# Altium project MGMEZZ04.PrjPCB (part 1 of 3)
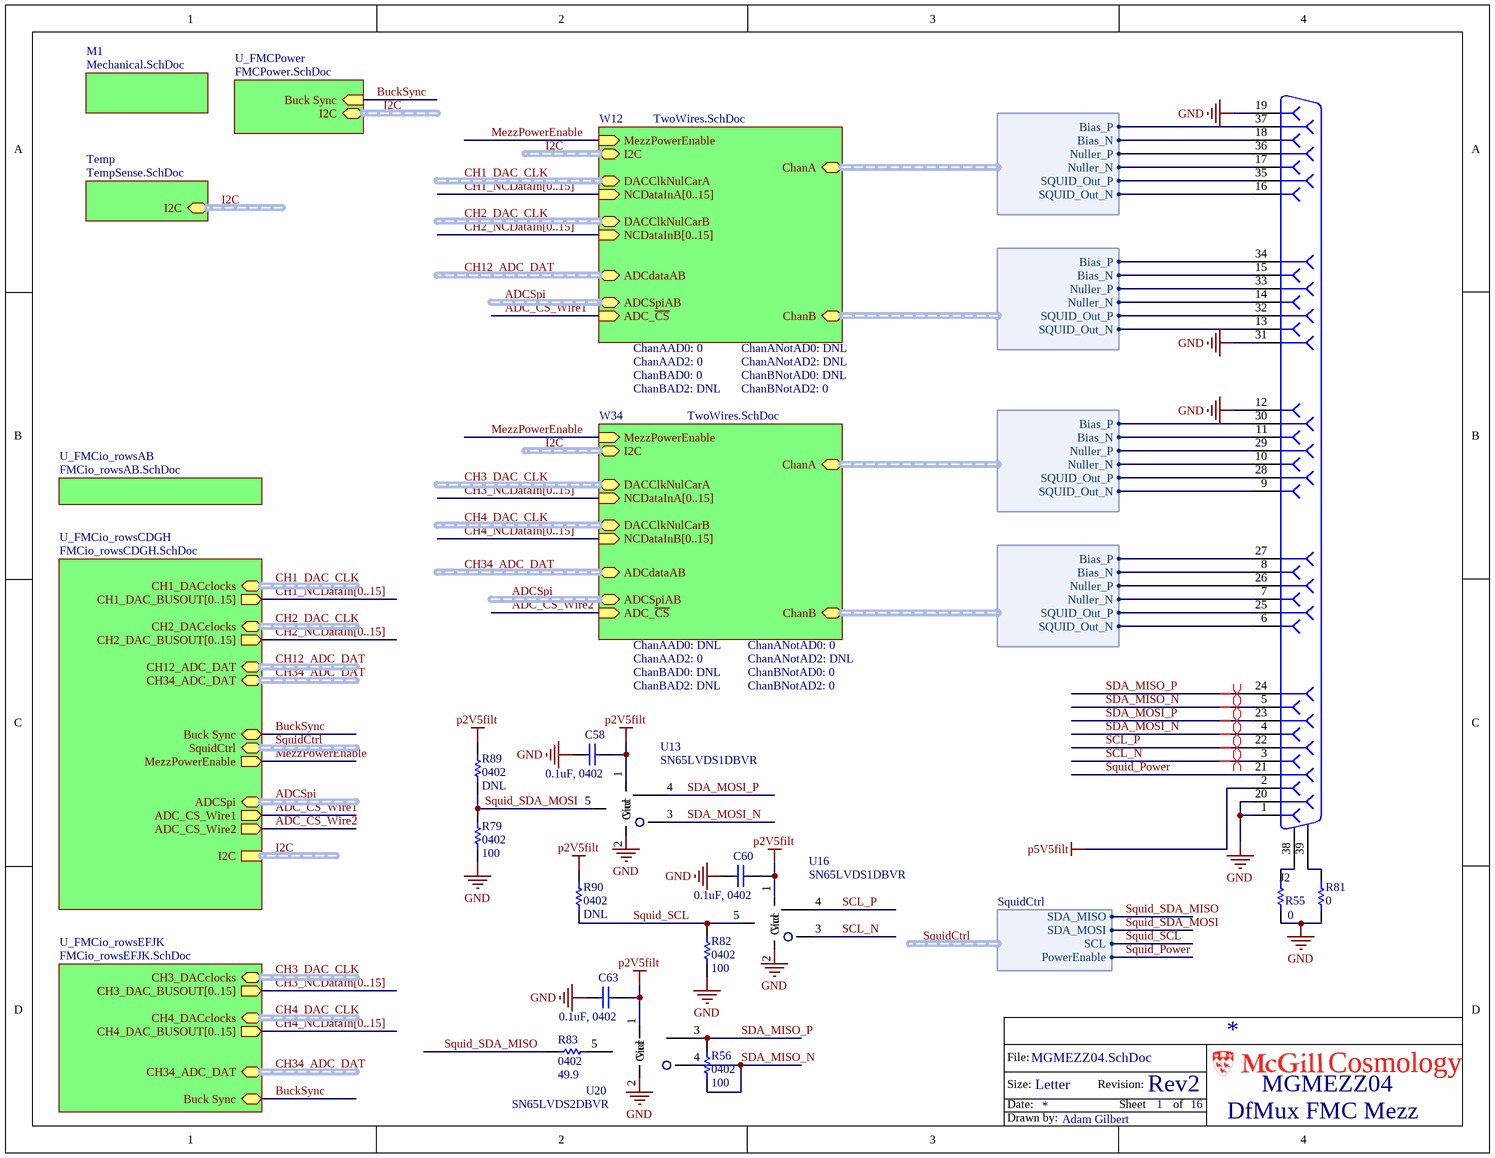
[diagram p0: MGMEZZ04.SchDoc]
ModelNumber: MGMEZZ04; ProjectTitle: Dan DfMux Mezz; revision: 0
15 sheets, 919 parts. Net scope: hierarchical (ports join the sheet entries above them; power ports are global).
Board file: MGMEZZ04.PcbDoc
Sheets:
  MGMEZZ04.SchDoc
    U_FMCio_rowsAB = FMCio_rowsAB.SchDoc
    U_FMCio_rowsCDGH = FMCio_rowsCDGH.SchDoc
    U_FMCio_rowsEFJK = FMCio_rowsEFJK.SchDoc
      Dup2 = BusDup.SchDoc
      Dup1 = BusDup.SchDoc
    U_FMCPower = FMCPower.SchDoc
      BP = BuckReg.SchDoc
      BN = BuckReg.SchDoc
    W12 = TwoWires.SchDoc
      DACNulCarA = NullerCarrier.SchDoc
        N = DAC.SchDoc
          PR = ProgramableResistor.SchDoc
        C = DAC.SchDoc
          PR = ProgramableResistor.SchDoc
        Tr1 = LvlTranslate.SchDoc
      DemodAB = ADC.SchDoc
      DACNulCarB = NullerCarrier.SchDoc
        N = DAC.SchDoc
          PR = ProgramableResistor.SchDoc
        C = DAC.SchDoc
          PR = ProgramableResistor.SchDoc
        Tr1 = LvlTranslate.SchDoc
    W34 = TwoWires.SchDoc
      DACNulCarA = NullerCarrier.SchDoc
        N = DAC.SchDoc
          PR = ProgramableResistor.SchDoc
        C = DAC.SchDoc
          PR = ProgramableResistor.SchDoc
        Tr1 = LvlTranslate.SchDoc
      DemodAB = ADC.SchDoc
      DACNulCarB = NullerCarrier.SchDoc
        N = DAC.SchDoc
          PR = ProgramableResistor.SchDoc
        C = DAC.SchDoc
          PR = ProgramableResistor.SchDoc
        Tr1 = LvlTranslate.SchDoc
    M1 = Mechanical.SchDoc
    Temp = TempSense.SchDoc

## Sheet MGMEZZ04.SchDoc
size Letter; Author: Adam Gilbert; CompanyName: McGill University; DrawnBy: Adam Gilbert; Organization: Altium Limited; Address1: McGill Cosmology; Address2: 3600 University Street; Address3: Montreal, Quebec; Address4: Canada; DocumentNumber: 1; Revision: Rev2; SheetNumber: 1; SheetTotal: 16; ProjectTitle: DfMux FMC Mezz; ModelNumber: MGMEZZ04; ProjectName: DfMux FMC Mezz

### Parts
C58  0.1uF, 0402  [0402]
C60  0.1uF, 0402  [0402]
C63  0.1uF, 0402  [0402]
J2  DB37F_Resize  [DSUB37-F]  (value not drawn)
R55  0  [0603]
R56  100  [0402]
R79  100  [0402]
R81  0  [0603]
R82  100  [0402]
R83  49.9  [0402]
R89  DNL  [0402]
R90  DNL  [0402]
U13  SN65LVDS1DBVR  [SOT23-5]
U16  SN65LVDS1DBVR  [SOT23-5]
U20  SN65LVDS2DBVR  [SOT23-5]

### Sub-sheets
M1 = Mechanical.SchDoc: no entries
Temp = TempSense.SchDoc: I2C (harness I2C)
U_FMCio_rowsAB = FMCio_rowsAB.SchDoc: no entries
U_FMCio_rowsCDGH = FMCio_rowsCDGH.SchDoc: I2C (harness I2C), ADCSpi (harness ADCSPI), ADC_CS_Wire1 (out), ADC_CS_Wire2 (out), CH1_DACclocks (harness DACclks), CH2_DACclocks (harness DACclks), Buck Sync, MezzPowerEnable (out), SquidCtrl (harness SquidCtrl), CH34_ADC_DAT (harness ADCData), CH12_ADC_DAT (harness ADCData), CH1_DAC_BUSOUT[0..15] (out), CH2_DAC_BUSOUT[0..15] (out)
U_FMCio_rowsEFJK = FMCio_rowsEFJK.SchDoc: CH34_ADC_DAT (harness ADCData), CH3_DACclocks (harness DACclks), CH4_DACclocks (harness DACclks), Buck Sync, CH3_DAC_BUSOUT[0..15] (out), CH4_DAC_BUSOUT[0..15] (out)
U_FMCPower = FMCPower.SchDoc: Buck Sync (in), I2C (harness I2C)
W12 = TwoWires.SchDoc: ADCSpiAB (harness ADCSPI), ADCdataAB (harness ADCData), NCDataInA[0..15] (in), NCDataInB[0..15] (in), DACClkNulCarA (harness DACclks), DACClkNulCarB (harness DACclks), ADC_~{CS} (in), ChanA (harness SQUID_CH_OUT), ChanB (harness SQUID_CH_OUT), I2C (harness I2C), MezzPowerEnable (in)  | ChanANotAD0: DNL; ChanANotAD2: DNL; ChanBNotAD0: DNL; ChanBNotAD2: 0; ChanAAD0: 0; ChanAAD2: 0; ChanBAD0: 0; ChanBAD2: DNL
W34 = TwoWires.SchDoc: ADCSpiAB (harness ADCSPI), ADCdataAB (harness ADCData), NCDataInA[0..15] (in), NCDataInB[0..15] (in), DACClkNulCarA (harness DACclks), DACClkNulCarB (harness DACclks), ADC_~{CS} (in), ChanA (harness SQUID_CH_OUT), ChanB (harness SQUID_CH_OUT), I2C (harness I2C), MezzPowerEnable (in)  | ChanANotAD0: 0; ChanANotAD2: DNL; ChanBNotAD0: 0; ChanBNotAD2: 0; ChanAAD0: DNL; ChanAAD2: 0; ChanBAD0: DNL; ChanBAD2: DNL

### Harnesses
SQUID_CH_OUT: Bias_P, Bias_N, Nuller_P, Nuller_N, SQUID_Out_P, SQUID_Out_N
SquidCtrl: SDA_MISO, SDA_MOSI, SCL, PowerEnable

### Nets
GND: C58.2 C60.2 C63.2 J2.1 J2.12 J2.19 J2.20 J2.31 R55.1 R79.1 R81.2 R82.1 U13.2(Gnd) U16.2(Gnd) U20.2(Gnd)
p2V5filt: C58.1 C60.1 C63.1 R89.2 R90.2 U13.1(Vcc) U16.1(Vcc) U20.1(Vcc)
p5V5filt: J2.2
ADC_CS_Wire1: sheet U_FMCio_rowsCDGH/ADC_CS_Wire1, sheet W12/ADC_~{CS}
ADC_CS_Wire2: sheet U_FMCio_rowsCDGH/ADC_CS_Wire2, sheet W34/ADC_~{CS}
ADCin1_N: J2.9 ; sheet W34/ChanA.SQUID_Out_N
ADCin1_N: J2.16 ; sheet W12/ChanA.SQUID_Out_N  [a separate net that carries the same name]
ADCin1_P: J2.28 ; sheet W34/ChanA.SQUID_Out_P
ADCin1_P: J2.35 ; sheet W12/ChanA.SQUID_Out_P  [a separate net that carries the same name]
ADCin2_N: J2.6 ; sheet W34/ChanB.SQUID_Out_N
ADCin2_N: J2.13 ; sheet W12/ChanB.SQUID_Out_N  [a separate net that carries the same name]
ADCin2_P: J2.25 ; sheet W34/ChanB.SQUID_Out_P
ADCin2_P: J2.32 ; sheet W12/ChanB.SQUID_Out_P  [a separate net that carries the same name]
BuckSync: sheet U_FMCio_rowsCDGH/Buck Sync, sheet U_FMCio_rowsEFJK/Buck Sync, sheet U_FMCPower/Buck Sync
CO.DACout_N: J2.8 ; sheet W34/ChanB.Bias_N
CO.DACout_N: J2.11 ; sheet W34/ChanA.Bias_N  [a separate net that carries the same name]
CO.DACout_N: J2.15 ; sheet W12/ChanB.Bias_N  [a separate net that carries the same name]
CO.DACout_N: J2.18 ; sheet W12/ChanA.Bias_N  [a separate net that carries the same name]
CO.DACout_P: J2.27 ; sheet W34/ChanB.Bias_P
CO.DACout_P: J2.30 ; sheet W34/ChanA.Bias_P  [a separate net that carries the same name]
CO.DACout_P: J2.34 ; sheet W12/ChanB.Bias_P  [a separate net that carries the same name]
CO.DACout_P: J2.37 ; sheet W12/ChanA.Bias_P  [a separate net that carries the same name]
MezzPowerEnable: sheet U_FMCio_rowsCDGH/MezzPowerEnable, sheet W12/MezzPowerEnable, sheet W34/MezzPowerEnable
NO.DACout_N: J2.7 ; sheet W34/ChanB.Nuller_N
NO.DACout_N: J2.10 ; sheet W34/ChanA.Nuller_N  [a separate net that carries the same name]
NO.DACout_N: J2.14 ; sheet W12/ChanB.Nuller_N  [a separate net that carries the same name]
NO.DACout_N: J2.17 ; sheet W12/ChanA.Nuller_N  [a separate net that carries the same name]
NO.DACout_P: J2.26 ; sheet W34/ChanB.Nuller_P
NO.DACout_P: J2.29 ; sheet W34/ChanA.Nuller_P  [a separate net that carries the same name]
NO.DACout_P: J2.33 ; sheet W12/ChanB.Nuller_P  [a separate net that carries the same name]
NO.DACout_P: J2.36 ; sheet W12/ChanA.Nuller_P  [a separate net that carries the same name]
SCL_N: J2.3 U16.3(A)
SCL_P: J2.22 U16.4(B)
SDA_MISO_N: J2.5 R56.2 U20.4(B)
SDA_MISO_P: J2.24 R56.1 U20.3(A)
SDA_MOSI_N: J2.4 U13.3(A)
SDA_MOSI_P: J2.23 U13.4(B)
Squid_Power: J2.21 ; sheet U_FMCio_rowsCDGH/SquidCtrl.PowerEnable
Squid_SCL: R82.2 R90.1 U16.5(R) ; sheet U_FMCio_rowsCDGH/SquidCtrl.SCL
Squid_SDA_MISO: R83.2 ; sheet U_FMCio_rowsCDGH/SquidCtrl.SDA_MISO
Squid_SDA_MOSI: R79.2 R89.1 U13.5(R) ; sheet U_FMCio_rowsCDGH/SquidCtrl.SDA_MOSI
NetJ2_38: J2.38(MH1) R55.2
NetJ2_39: J2.39(MH2) R81.1
NetR83_1: R83.1 U20.5(R)

### Buses and harness runs
bus CH1_NCDataIn[0..15] = sheet U_FMCio_rowsCDGH/CH1_DAC_BUSOUT[0..15]
bus CH1_NCDataIn[0..15] = sheet W12/NCDataInA[0..15]
bus CH2_NCDataIn[0..15] = sheet U_FMCio_rowsCDGH/CH2_DAC_BUSOUT[0..15]
bus CH2_NCDataIn[0..15] = sheet W12/NCDataInB[0..15]
bus CH3_NCDataIn[0..15] = sheet U_FMCio_rowsEFJK/CH3_DAC_BUSOUT[0..15]
bus CH3_NCDataIn[0..15] = sheet W34/NCDataInA[0..15]
bus CH4_NCDataIn[0..15] = sheet U_FMCio_rowsEFJK/CH4_DAC_BUSOUT[0..15]
bus CH4_NCDataIn[0..15] = sheet W34/NCDataInB[0..15]
harness ADCSpi = sheet U_FMCio_rowsCDGH/ADCSpi
harness ADCSpi = sheet W12/ADCSpiAB
harness ADCSpi = sheet W34/ADCSpiAB
harness CH1_DAC_CLK = sheet U_FMCio_rowsCDGH/CH1_DACclocks
harness CH1_DAC_CLK = sheet W12/DACClkNulCarA
harness CH2_DAC_CLK = sheet U_FMCio_rowsCDGH/CH2_DACclocks
harness CH2_DAC_CLK = sheet W12/DACClkNulCarB
harness CH3_DAC_CLK = sheet U_FMCio_rowsEFJK/CH3_DACclocks
harness CH3_DAC_CLK = sheet W34/DACClkNulCarA
harness CH4_DAC_CLK = sheet U_FMCio_rowsEFJK/CH4_DACclocks
harness CH4_DAC_CLK = sheet W34/DACClkNulCarB
harness CH12_ADC_DAT = sheet U_FMCio_rowsCDGH/CH12_ADC_DAT
harness CH12_ADC_DAT = sheet W12/ADCdataAB
harness CH34_ADC_DAT = sheet U_FMCio_rowsCDGH/CH34_ADC_DAT
harness CH34_ADC_DAT = sheet U_FMCio_rowsEFJK/CH34_ADC_DAT
harness CH34_ADC_DAT = sheet W34/ADCdataAB
harness I2C = sheet Temp/I2C
harness I2C = sheet U_FMCio_rowsCDGH/I2C
harness I2C = sheet U_FMCPower/I2C
harness I2C = sheet W12/I2C
harness I2C = sheet W34/I2C
harness SquidCtrl = sheet U_FMCio_rowsCDGH/SquidCtrl

### Layout directives
differential pair: SCL_N, SCL_P, SDA_MISO_N, SDA_MISO_P, SDA_MOSI_N, SDA_MOSI_P

### Notes on the sheet
- File:
- Size:
- Date:
- Letter
- Revision:
- Sheet
- of
- Cosmology
- Drawn by:

### Library data of the parts
C58 C60 C63 = CAP 0603: Capacitor, Ceramic, 0402; Part Constraints: 10% 10V X5R 0402; Manufacturer: TDK Corporation; Manufacturer Part Number 1: C1005X5R1A104K050BA; Temperature Coefficient: X5R; Assembly Comments: none; Value: 0.1uF, 0402; Supplier 1: Digi-Key; Supplier Part Number 1: 445-1265-1-ND; Operating Temperature: -55°C ~ 85°C; Thickness (Max): 0.022" (0.55mm); Packaging: Cut Tape (CT)
J2 = DB37F_Resize: DB37F; Manufacturer: Norcomp Inc.; Part Constraints: 182-037-213R181; Assembly Comments: none; Manufacturer Part Number 1: 182-037-213R181; Supplier 1: Digi-Key; Supplier Part Number 1: 182-837FE-ND
R55 R81 = RES 0603: Manufacturer: e.g CRCW0603 series; Part constraints: 0 1/10W 1% 100ppm/C 0603; Assembly Comments: none; Manufacturer Part Number 1: e.g CRCW0603 series; Value: 0; Supplier 1: Digi-Key; Supplier Part Number 1: 541-0.0GCT-ND
R56 R79 R82 R83 R89 R90 = RES 0402: Resistor; Manufacturer: Generic; Part Constraints: 1% 1/10W 100ppm 0402; Assembly Comments: none; Manufacturer Part Number 1: Generic
  R56 R79 R82: Value: 100
  R83: Value: 49.9
  R89 R90: Value: DNL
U13 U16 = SN65LVDS1DBVR: IC HIGH DIFF LINE DRIVER SOT23-5; Manufacturer: Texas Instruments; Assembly Comments: none; Supplier 1: Digi-Key; Manufacturer Part Number 1: SN65LVDS1DBVR; Packaging: Cut Tape (CT); Supplier Part Number 1: 296-6919-1-ND; Part Constraints: SN65LVDS1DBVR
U20 = SN65LVDS2DBVR: IC DIF LINE DRVR/RCVR HS SOT23-5; Manufacturer: Texas Instruments; Assembly Comments: none; Supplier 1: Digi-Key; Manufacturer Part Number 1: SN65LVDS2DBVR; Packaging: Cut Tape (CT); Supplier Part Number 1: 296-6920-1-ND; Part Constraints: SN65LVDS2DBVR

## Sheet FMCio_rowsAB.SchDoc
size Letter; PageSetup: Record=PageOptions|CenterHorizontal=True|CenterVertical=True|PrintScale=1.00|XCorrection=1.00|YCorrection=1.00|PrintKind=0|BorderSize=5000000|LeftOffset=0|BottomOffset=0|Orientation=2|PaperLength=1000|PaperWidth=1000|Scale=100|PaperSource=7|PrintQuality=-4|MediaType=1|DitherType=10|PaperKind=Letter|PrintScaleMode=1; Author: Adam Gilbert; CompanyName: McGill University; DrawnBy: Adam Gilbert; Organization: Altium Limited; Address1: McGill Cosmology; Address2: 3600 University Street; Address3: Montreal, Quebec; Address4: Canada; DocumentNumber: 11; Revision: Rev2; SheetNumber: 11; SheetTotal: 16; ProjectTitle: DfMux FMC Mezz; ModelNumber: MGMEZZ04; ProjectName: DfMux FMC Mezz
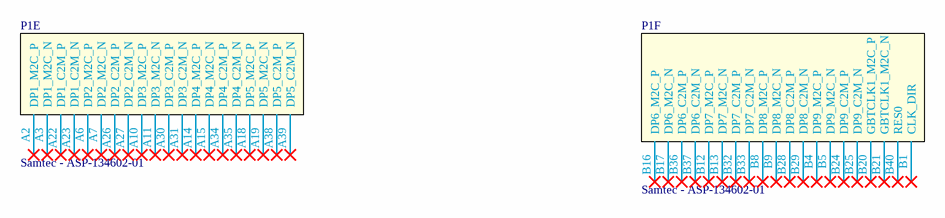
[diagram p1: FMCio_rowsAB.SchDoc]

### Parts
P1  Samtec - ASP-134602-01  [BTB-SM1-27-2V400M]  (parts E,F of 14)

### Nets

Not connected (* = marked no-connect by the designer): P1 A2(DP1_M2C_P)* A3(DP1_M2C_N)* A6(DP2_M2C_P)* A7(DP2_M2C_N)* A10(DP3_M2C_P)* A11(DP3_M2C_N)* A14(DP4_M2C_P)* A15(DP4_M2C_N)* A18(DP5_M2C_P)* A19(DP5_M2C_N)* A22(DP1_C2M_P)* A23(DP1_C2M_N)* A26(DP2_C2M_P)* A27(DP2_C2M_N)* A30(DP3_C2M_P)* A31(DP3_C2M_N)* A34(DP4_C2M_P)* A35(DP4_C2M_N)* A38(DP5_C2M_P)* A39(DP5_C2M_N)* B1(CLK_DIR)* B4(DP9_M2C_P)* B5(DP9_M2C_N)* B8(DP8_M2C_P)* B9(DP8_M2C_N)* B12(DP7_M2C_P)* B13(DP7_M2C_N)* B16(DP6_M2C_P)* B17(DP6_M2C_N)* B20(GBTCLK1_M2C_P)* B21(GBTCLK1_M2C_N)* B24(DP9_C2M_P)* B25(DP9_C2M_N)* B28(DP8_C2M_P)* B29(DP8_C2M_N)* B32(DP7_C2M_P)* B33(DP7_C2M_N)* B36(DP6_C2M_P)* B37(DP6_C2M_N)* B40(RES0)*

### Notes on the sheet
- File:
- Size:
- Date:
- Letter
- Revision:
- Sheet
- of
- Cosmology
- Drawn by:

### Library data of the parts
P1 = Samtec - ASP-134602-01: Samtec ASP-134602-01; Assembly Comments: none; Manufacturer: Samtec; Part constraints: Samtec ASP-134602-01; Manufacturer Part Number 1: Samtec ASP-134602-01

## Sheet FMCio_rowsCDGH.SchDoc
size Letter; PageSetup: Record=PageOptions|CenterHorizontal=True|CenterVertical=True|PrintScale=0.91|XCorrection=1.00|YCorrection=1.00|PrintKind=0|BorderSize=5000000|LeftOffset=0|BottomOffset=0|Orientation=2|PaperLength=1000|PaperWidth=1000|Scale=100|PaperSource=7|PrintQuality=-4|MediaType=1|DitherType=10|PaperKind=Letter|PrintScaleMode=1; Author: Adam Gilbert; CompanyName: McGill University; DrawnBy: Adam Gilbert; Organization: Altium Limited; Address1: McGill Cosmology; Address2: 3600 University Street; Address3: Montreal, Quebec; Address4: Canada; DocumentNumber: 12; Revision: Rev2; SheetNumber: 12; SheetTotal: 16; ProjectTitle: DfMux FMC Mezz; ModelNumber: MGMEZZ04; ProjectName: DfMux FMC Mezz
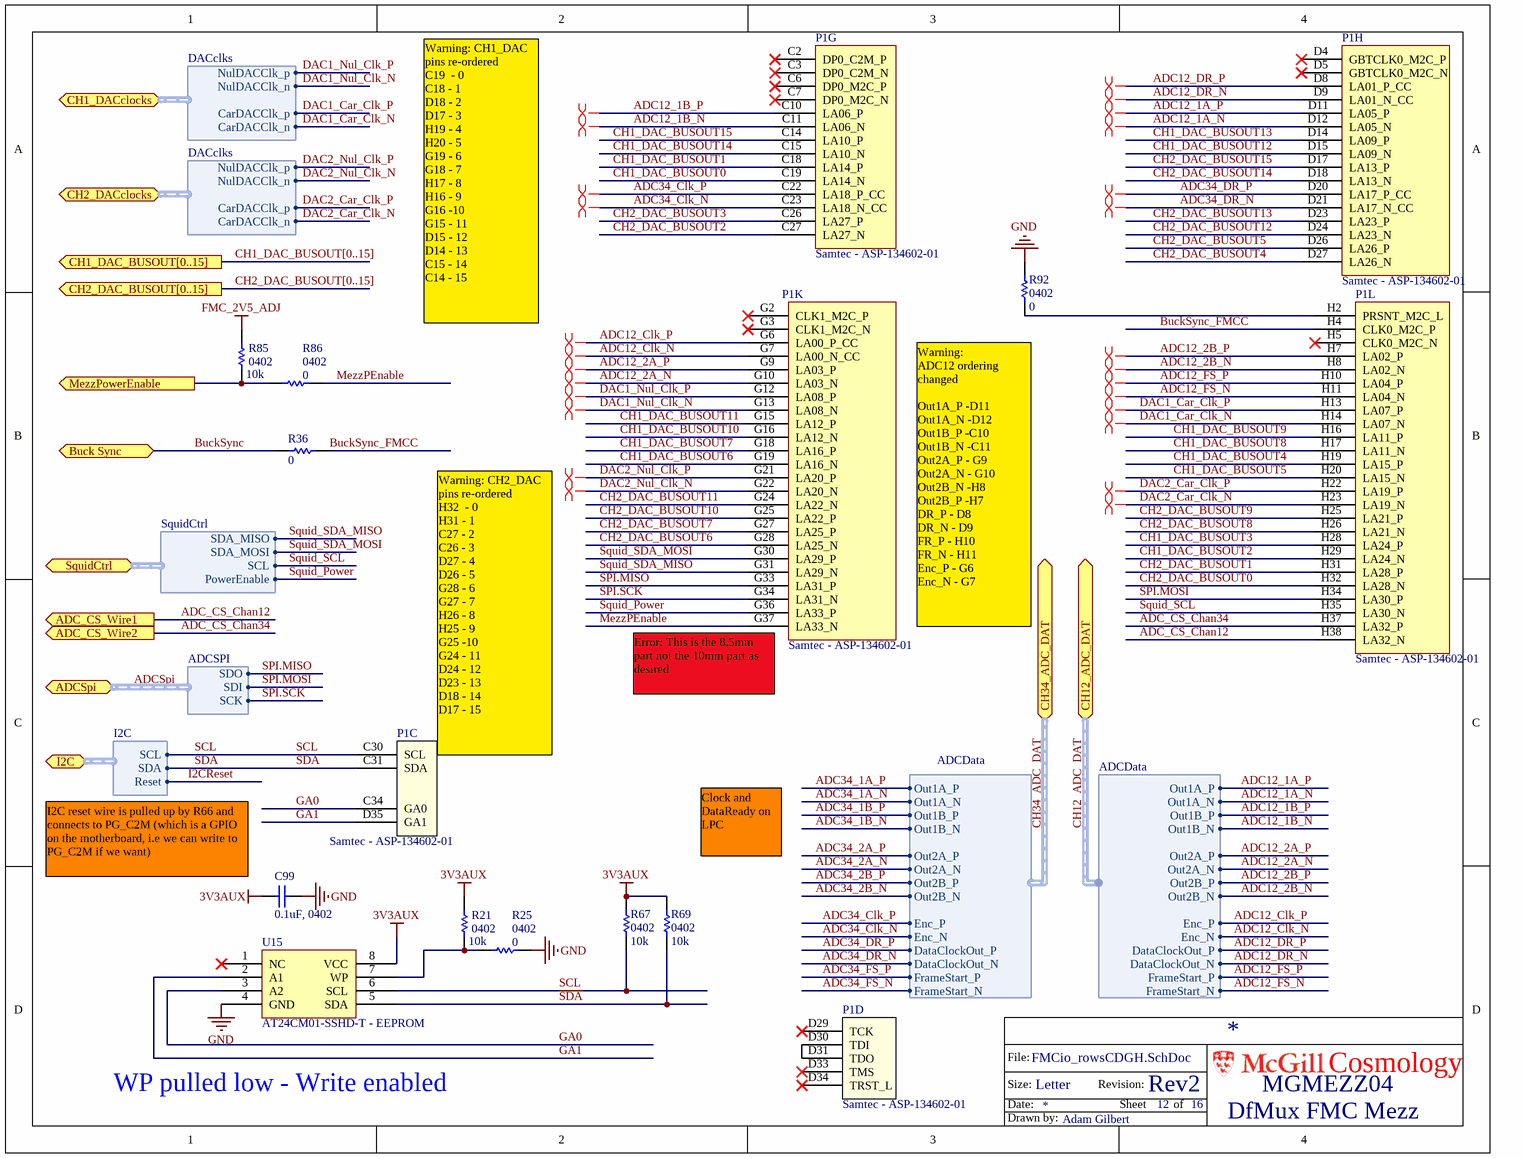
[diagram p2: FMCio_rowsCDGH.SchDoc]

### Parts
C99  0.1uF, 0402  [0402]
P1  Samtec - ASP-134602-01  [BTB-SM1-27-2V400M]  (parts C,D,G,H,K,L of 14)
R21  10k  [0402]
R25  0  [0402]
R36  0  [0805]
R67  10k  [0402]
R69  10k  [0402]
R85  10k  [0402]
R86  0  [0402]
R92  0  [0402]
U15  AT24CM01-SSHD-T - EEPROM  [SO8/L200]

### Ports
ADC_CS_Wire1 (out), ADC_CS_Wire2 (out), ADCSpi (harness ADCSPI), Buck Sync, CH1_DAC_BUSOUT[0..15] (out), CH1_DACclocks (harness DACclks), CH2_DAC_BUSOUT[0..15] (out), CH2_DACclocks (harness DACclks), CH12_ADC_DAT (harness ADCData), CH34_ADC_DAT (harness ADCData), I2C (harness I2C), MezzPowerEnable (out), SquidCtrl (harness SquidCtrl)

### Harnesses
I2C: SCL, SDA, Reset
ADCSPI: SDO, SDI, SCK
ADCData: Enc_P, Enc_N, Out1A_P, Out1A_N, Out1B_P, Out1B_N, Out2A_P, Out2A_N, Out2B_P, Out2B_N, DataClockOut_P, DataClockOut_N, FrameStart_P, FrameStart_N
DACclks: NulDACClk_p, NulDACClk_n, CarDACClk_p, CarDACClk_n
SquidCtrl: SDA_MISO, SDA_MOSI, SCL, PowerEnable

### Nets
3V3AUX: C99.1 R21.1 R67.1 R69.1 U15.8(VCC)
FMC_2V5_ADJ: R85.1
GND: C99.2 R25.2 R92.2 U15.4(GND)
~{SDA}: P1.C31(SDA) R69.2 U15.5(SDA) ; port I2C.SDA  [also labelled SDA]  [project net I2C.SDA]
ADC12_1A_N: P1.D12(LA05_N) ; port CH12_ADC_DAT.Out1A_N  [project net CH12_ADC_DAT.Out1A_N]
ADC12_1A_P: P1.D11(LA05_P) ; port CH12_ADC_DAT.Out1A_P  [project net CH12_ADC_DAT.Out1A_P]
ADC12_1B_N: P1.C11(LA06_N) ; port CH12_ADC_DAT.Out1B_N  [project net CH12_ADC_DAT.Out1B_N]
ADC12_1B_P: P1.C10(LA06_P) ; port CH12_ADC_DAT.Out1B_P  [project net CH12_ADC_DAT.Out1B_P]
ADC12_2A_N: P1.G10(LA03_N) ; port CH12_ADC_DAT.Out2A_N  [project net CH12_ADC_DAT.Out2A_N]
ADC12_2A_P: P1.G9(LA03_P) ; port CH12_ADC_DAT.Out2A_P  [project net CH12_ADC_DAT.Out2A_P]
ADC12_2B_N: P1.H8(LA02_N) ; port CH12_ADC_DAT.Out2B_N  [project net CH12_ADC_DAT.Out2B_N]
ADC12_2B_P: P1.H7(LA02_P) ; port CH12_ADC_DAT.Out2B_P  [project net CH12_ADC_DAT.Out2B_P]
ADC12_Clk_N: P1.G7(LA00_N_CC) ; port CH12_ADC_DAT.Enc_N  [project net CH12_ADC_DAT.Enc_N]
ADC12_Clk_P: P1.G6(LA00_P_CC) ; port CH12_ADC_DAT.Enc_P  [project net CH12_ADC_DAT.Enc_P]
ADC12_DR_N: P1.D9(LA01_N_CC) ; port CH12_ADC_DAT.DataClockOut_N  [project net CH12_ADC_DAT.DataClockOut_N]
ADC12_DR_P: P1.D8(LA01_P_CC) ; port CH12_ADC_DAT.DataClockOut_P  [project net CH12_ADC_DAT.DataClockOut_P]
ADC12_FS_N: P1.H11(LA04_N) ; port CH12_ADC_DAT.FrameStart_N  [project net CH12_ADC_DAT.FrameStart_N]
ADC12_FS_P: P1.H10(LA04_P) ; port CH12_ADC_DAT.FrameStart_P  [project net CH12_ADC_DAT.FrameStart_P]
ADC34_Clk_N: P1.C23(LA18_N_CC) ; port CH34_ADC_DAT.Enc_N  [project net CH34_ADC_DAT.Enc_N]
ADC34_Clk_P: P1.C22(LA18_P_CC) ; port CH34_ADC_DAT.Enc_P  [project net CH34_ADC_DAT.Enc_P]
ADC34_DR_N: P1.D21(LA17_N_CC) ; port CH34_ADC_DAT.DataClockOut_N  [project net CH34_ADC_DAT.DataClockOut_N]
ADC34_DR_P: P1.D20(LA17_P_CC) ; port CH34_ADC_DAT.DataClockOut_P  [project net CH34_ADC_DAT.DataClockOut_P]
ADC_CS_Chan12: P1.H38(LA32_N) ; port ADC_CS_Wire1  [project net ADC_CS_Wire1]
ADC_CS_Chan34: P1.H37(LA32_P) ; port ADC_CS_Wire2  [project net ADC_CS_Wire2]
BuckSync: R36.2 ; port Buck Sync
BuckSync_FMCC: P1.H4(CLK0_M2C_P) R36.1
CH1_DAC_BUSOUT0: P1.C19(LA14_N)  [project net CH1_NCDataIn0]
CH1_DAC_BUSOUT1: P1.C18(LA14_P)  [project net CH1_NCDataIn1]
CH1_DAC_BUSOUT2: P1.H29(LA24_N)  [project net CH1_NCDataIn2]
CH1_DAC_BUSOUT3: P1.H28(LA24_P)  [project net CH1_NCDataIn3]
CH1_DAC_BUSOUT4: P1.H19(LA15_P)  [project net CH1_NCDataIn4]
CH1_DAC_BUSOUT5: P1.H20(LA15_N)  [project net CH1_NCDataIn5]
CH1_DAC_BUSOUT6: P1.G19(LA16_N)  [project net CH1_NCDataIn6]
CH1_DAC_BUSOUT7: P1.G18(LA16_P)  [project net CH1_NCDataIn7]
CH1_DAC_BUSOUT8: P1.H17(LA11_N)  [project net CH1_NCDataIn8]
CH1_DAC_BUSOUT9: P1.H16(LA11_P)  [project net CH1_NCDataIn9]
CH1_DAC_BUSOUT10: P1.G16(LA12_N)  [project net CH1_NCDataIn10]
CH1_DAC_BUSOUT11: P1.G15(LA12_P)  [project net CH1_NCDataIn11]
CH1_DAC_BUSOUT12: P1.D15(LA09_N)  [project net CH1_NCDataIn12]
CH1_DAC_BUSOUT13: P1.D14(LA09_P)  [project net CH1_NCDataIn13]
CH1_DAC_BUSOUT14: P1.C15(LA10_N)  [project net CH1_NCDataIn14]
CH1_DAC_BUSOUT15: P1.C14(LA10_P)  [project net CH1_NCDataIn15]
CH2_DAC_BUSOUT0: P1.H32(LA28_N)  [project net CH2_NCDataIn0]
CH2_DAC_BUSOUT1: P1.H31(LA28_P)  [project net CH2_NCDataIn1]
CH2_DAC_BUSOUT2: P1.C27(LA27_N)  [project net CH2_NCDataIn2]
CH2_DAC_BUSOUT3: P1.C26(LA27_P)  [project net CH2_NCDataIn3]
CH2_DAC_BUSOUT4: P1.D27(LA26_N)  [project net CH2_NCDataIn4]
CH2_DAC_BUSOUT5: P1.D26(LA26_P)  [project net CH2_NCDataIn5]
CH2_DAC_BUSOUT6: P1.G28(LA25_N)  [project net CH2_NCDataIn6]
CH2_DAC_BUSOUT7: P1.G27(LA25_P)  [project net CH2_NCDataIn7]
CH2_DAC_BUSOUT8: P1.H26(LA21_N)  [project net CH2_NCDataIn8]
CH2_DAC_BUSOUT9: P1.H25(LA21_P)  [project net CH2_NCDataIn9]
CH2_DAC_BUSOUT10: P1.G25(LA22_P)  [project net CH2_NCDataIn10]
CH2_DAC_BUSOUT11: P1.G24(LA22_N)  [project net CH2_NCDataIn11]
CH2_DAC_BUSOUT12: P1.D24(LA23_N)  [project net CH2_NCDataIn12]
CH2_DAC_BUSOUT13: P1.D23(LA23_P)  [project net CH2_NCDataIn13]
CH2_DAC_BUSOUT14: P1.D18(LA13_N)  [project net CH2_NCDataIn14]
CH2_DAC_BUSOUT15: P1.D17(LA13_P)  [project net CH2_NCDataIn15]
DAC1_Car_Clk_N: P1.H14(LA07_N) ; port CH1_DACclocks.CarDACClk_n  [project net CH1_DAC_CLK.CarDACClk_n]
DAC1_Car_Clk_P: P1.H13(LA07_P) ; port CH1_DACclocks.CarDACClk_p  [project net CH1_DAC_CLK.CarDACClk_p]
DAC1_Nul_Clk_N: P1.G13(LA08_N) ; port CH1_DACclocks.NulDACClk_n  [project net CH1_DAC_CLK.NulDACClk_n]
DAC1_Nul_Clk_P: P1.G12(LA08_P) ; port CH1_DACclocks.NulDACClk_p  [project net CH1_DAC_CLK.NulDACClk_p]
DAC2_Car_Clk_N: P1.H23(LA19_N) ; port CH2_DACclocks.CarDACClk_n  [project net CH2_DAC_CLK.CarDACClk_n]
DAC2_Car_Clk_P: P1.H22(LA19_P) ; port CH2_DACclocks.CarDACClk_p  [project net CH2_DAC_CLK.CarDACClk_p]
DAC2_Nul_Clk_N: P1.G22(LA20_N) ; port CH2_DACclocks.NulDACClk_n  [project net CH2_DAC_CLK.NulDACClk_n]
DAC2_Nul_Clk_P: P1.G21(LA20_P) ; port CH2_DACclocks.NulDACClk_p  [project net CH2_DAC_CLK.NulDACClk_p]
GA0: P1.C34(GA0) U15.3(A2)
GA1: P1.D35(GA1) U15.2(A1)
MezzPEnable: P1.G37(LA33_N) R86.2
MezzPowerEnable: R85.2 R86.1 ; port MezzPowerEnable
SCL: P1.C30(SCL) R67.2 U15.6(SCL) ; port I2C.SCL  [project net I2C.SCL]
SPI.MISO: P1.G33(LA31_P) ; port ADCSpi.SDO  [project net ADCSpi.SDO]
SPI.MOSI: P1.H34(LA30_P) ; port ADCSpi.SDI  [project net ADCSpi.SDI]
SPI.SCK: P1.G34(LA31_N) ; port ADCSpi.SCK  [project net ADCSpi.SCK]
Squid_Power: P1.G36(LA33_P) ; port SquidCtrl.PowerEnable
Squid_SCL: P1.H35(LA30_N) ; port SquidCtrl.SCL
Squid_SDA_MISO: P1.G31(LA29_N) ; port SquidCtrl.SDA_MISO
Squid_SDA_MOSI: P1.G30(LA29_P) ; port SquidCtrl.SDA_MOSI
NetP1_D30: P1.D30(TDI) P1.D31(TDO)
NetP1_H2: P1.H2(PRSNT_M2C_L) R92.1
NetR21_2: R21.2 R25.1 U15.7(WP)

Not connected (* = marked no-connect by the designer): P1 C2(DP0_C2M_P)* C3(DP0_C2M_N)* C6(DP0_M2C_P)* C7(DP0_M2C_N)* D4(GBTCLK0_M2C_P)* D5(GBTCLK0_M2C_N)* D29(TCK)* D33(TMS)* D34(TRST_L)* G2(CLK1_M2C_P)* G3(CLK1_M2C_N)* H5(CLK0_M2C_N)*; U15 1(NC)*

### Buses and harness runs
bus CH1_DAC_BUSOUT[0..15] = port CH1_DAC_BUSOUT[0..15]
bus CH2_DAC_BUSOUT[0..15] = port CH2_DAC_BUSOUT[0..15]
harness ADCSpi = port ADCSpi
harness CH12_ADC_DAT = port CH12_ADC_DAT
harness CH34_ADC_DAT = port CH34_ADC_DAT

### Layout directives
differential pair: CH1_DAC_CLK.CarDACClk_n, CH1_DAC_CLK.CarDACClk_p, CH1_DAC_CLK.NulDACClk_n, CH1_DAC_CLK.NulDACClk_p, CH2_DAC_CLK.CarDACClk_n, CH2_DAC_CLK.CarDACClk_p, CH2_DAC_CLK.NulDACClk_n, CH2_DAC_CLK.NulDACClk_p, CH12_ADC_DAT.DataClockOut_N, CH12_ADC_DAT.DataClockOut_P, CH12_ADC_DAT.Enc_N, CH12_ADC_DAT.Enc_P, CH12_ADC_DAT.FrameStart_N, CH12_ADC_DAT.FrameStart_P, CH12_ADC_DAT.Out1A_N, CH12_ADC_DAT.Out1A_P, CH12_ADC_DAT.Out1B_N, CH12_ADC_DAT.Out1B_P, CH12_ADC_DAT.Out2A_N, CH12_ADC_DAT.Out2A_P, CH12_ADC_DAT.Out2B_N, CH12_ADC_DAT.Out2B_P, CH34_ADC_DAT.DataClockOut_N, CH34_ADC_DAT.DataClockOut_P, CH34_ADC_DAT.Enc_N, CH34_ADC_DAT.Enc_P

### Notes on the sheet
- Warning: CH1_DAC pins re-ordered
  C19  - 0
  C18 - 1
  D18 - 2
  D17 - 3
  H19 - 4
  H20 - 5
  G19 - 6
  G18 - 7
  H17 - 8
  H16 - 9
  G16 -10
  G15 - 11
  D15 - 12
  D14 - 13
  C15 - 14
  C14 - 15
- (near R92) Warning:
  ADC12 ordering changed
  Out1A_P -D11
  Out1A_N -D12
  Out1B_P -C10
  Out1B_N -C11
  Out2A_P - G9
  Out2A_N - G10
  Out2B_N -H8
  Out2B_P -H7
  DR_P - D8
  DR_N - D9
  FR_P - H10
  FR_N - H11
  Enc_P - G6
  Enc_N - G7
- (near P1) Error: This is the 8.5mm part not the 10mm part as desired
- (near P1) Warning: CH2_DAC pins re-ordered
  H32  - 0
  H31 - 1
  C27 - 2
  C26 - 3
  D27 - 4
  D26 - 5
  G28 - 6
  G27 - 7
  H26 - 8
  H25 - 9
  G25 -10
  G24 - 11
  D24 - 12
  D23 - 13
  D18 - 14
  D17 - 15
- (near C99) I2C reset wire is pulled up by R66 and connects to PG_C2M (which is a GPIO on the motherboard, i.e we can write to PG_C2M if we want)
- Clock and DataReady on LPC
- WP pulled low - Write enabled
- File:
- Size:
- Date:
- Letter
- Revision:
- Sheet
- of
- Cosmology
- Drawn by:

### Library data of the parts
C99 = CAP 0603: as C58 on sheet MGMEZZ04; Value: 0.1uF, 0402; Supplier 1: Digi-Key; Supplier Part Number 1: 445-1265-1-ND; Operating Temperature: -55°C ~ 85°C; Thickness (Max): 0.022" (0.55mm); Packaging: Cut Tape (CT)
P1 = Samtec - ASP-134602-01: as P1 on sheet FMCio_rowsAB; Manufacturer: Samtec; Part constraints: Samtec ASP-134602-01; Manufacturer Part Number 1: Samtec ASP-134602-01
R21 R25 R67 R69 R85 R86 R92 = RES 0402: as R56 on sheet MGMEZZ04; Manufacturer Part Number 1: Generic
  R21 R67 R69 R85: Value: 10k
  R25 R86 R92: Value: 0
R36 = Res1812: RES 0.0 OHM 1/8W 0805 SMD; Manufacturer: e.g Vishay/Dale; Part constraints: 0Ohm jumper, >=4A, 0805, <=5mOhms; Manufacturer Part Number 1: e.g CRCW08050000Z0EAHP; Assembly Comments: none; Value: 0; Supplier 1: Newark; Supplier Part Number 1: 68R2993
U15 = AT24C1024B: IC EEPROM 1MBIT 1MHZ 8SOIC; Manufacturer: Atmel; Assembly Comments: none; Part constraints: AT24CM01-SSHD-T; Manufacturer Part Number 1: AT24CM01-SSHD-T; Supplier 1: Digikey; Supplier Part Number 1: AT24CM01-SSHD-TCT-ND

## Sheet FMCio_rowsEFJK.SchDoc
size Letter; PageSetup: Record=PageOptions|CenterHorizontal=True|CenterVertical=True|PrintScale=1.00|XCorrection=1.00|YCorrection=1.00|PrintKind=0|BorderSize=5000000|LeftOffset=0|BottomOffset=0|Orientation=2|PaperLength=1000|PaperWidth=1000|Scale=100|PaperSource=7|PrintQuality=-4|MediaType=1|DitherType=10|PaperKind=Letter|PrintScaleMode=1; Author: Adam Gilbert; CompanyName: McGill University; DrawnBy: Adam Gilbert; Organization: Altium Limited; Address1: McGill Cosmology; Address2: 3600 University Street; Address3: Montreal, Quebec; Address4: Canada; DocumentNumber: 13; Revision: Rev2; SheetNumber: 13; SheetTotal: 16; ProjectTitle: DfMux FMC Mezz; ModelNumber: MGMEZZ04; ProjectName: DfMux FMC Mezz
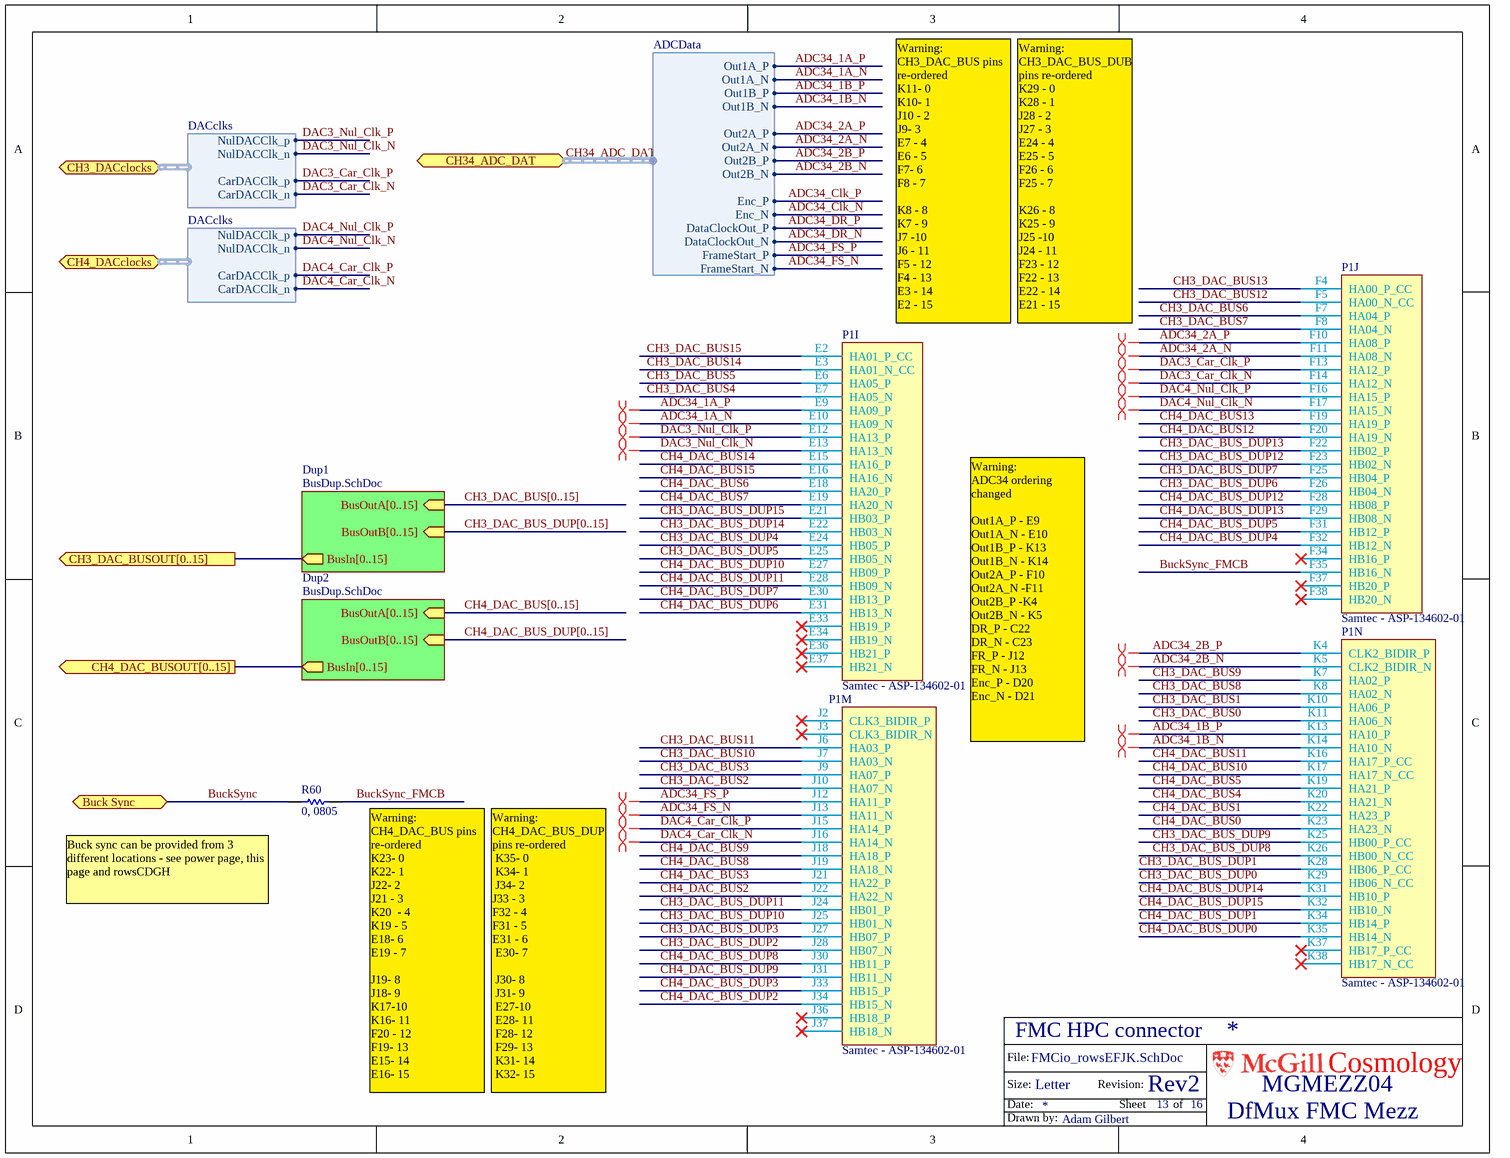
[diagram p3: FMCio_rowsEFJK.SchDoc]

### Parts
P1  Samtec - ASP-134602-01  [BTB-SM1-27-2V400M]  (parts I,J,M,N of 14)
R60  0, 0805  [0805]

### Sub-sheets
Dup1 = BusDup.SchDoc: BusIn[0..15] (out), BusOutA[0..15] (in), BusOutB[0..15] (in)
Dup2 = BusDup.SchDoc: BusIn[0..15] (out), BusOutA[0..15] (in), BusOutB[0..15] (in)

### Ports
Buck Sync, CH3_DAC_BUSOUT[0..15] (out), CH3_DACclocks (harness DACclks), CH4_DAC_BUSOUT[0..15] (out), CH4_DACclocks (harness DACclks), CH34_ADC_DAT (harness ADCData)

### Harnesses
ADCData: Enc_P, Enc_N, Out1A_P, Out1A_N, Out1B_P, Out1B_N, Out2A_P, Out2A_N, Out2B_P, Out2B_N, DataClockOut_P, DataClockOut_N, FrameStart_P, FrameStart_N
DACclks: NulDACClk_p, NulDACClk_n, CarDACClk_p, CarDACClk_n

### Nets
ADC34_1A_N: P1.E10(HA09_N) ; port CH34_ADC_DAT.Out1A_N  [project net CH34_ADC_DAT.Out1A_N]
ADC34_1A_P: P1.E9(HA09_P) ; port CH34_ADC_DAT.Out1A_P  [project net CH34_ADC_DAT.Out1A_P]
ADC34_1B_N: P1.K14(HA10_N) ; port CH34_ADC_DAT.Out1B_N  [project net CH34_ADC_DAT.Out1B_N]
ADC34_1B_P: P1.K13(HA10_P) ; port CH34_ADC_DAT.Out1B_P  [project net CH34_ADC_DAT.Out1B_P]
ADC34_2A_N: P1.F11(HA08_N) ; port CH34_ADC_DAT.Out2A_N  [project net CH34_ADC_DAT.Out2A_N]
ADC34_2A_P: P1.F10(HA08_P) ; port CH34_ADC_DAT.Out2A_P  [project net CH34_ADC_DAT.Out2A_P]
ADC34_2B_N: P1.K5(CLK2_BIDIR_N) ; port CH34_ADC_DAT.Out2B_N  [project net CH34_ADC_DAT.Out2B_N]
ADC34_2B_P: P1.K4(CLK2_BIDIR_P) ; port CH34_ADC_DAT.Out2B_P  [project net CH34_ADC_DAT.Out2B_P]
ADC34_FS_N: P1.J13(HA11_N) ; port CH34_ADC_DAT.FrameStart_N  [project net CH34_ADC_DAT.FrameStart_N]
ADC34_FS_P: P1.J12(HA11_P) ; port CH34_ADC_DAT.FrameStart_P  [project net CH34_ADC_DAT.FrameStart_P]
BuckSync: R60.2 ; port Buck Sync
BuckSync_FMCB: P1.F35(HB16_N) R60.1
CH3_DAC_BUS0: P1.K11(HA06_N)
CH3_DAC_BUS1: P1.K10(HA06_P)
CH3_DAC_BUS2: P1.J10(HA07_N)
CH3_DAC_BUS3: P1.J9(HA07_P)
CH3_DAC_BUS4: P1.E7(HA05_N)
CH3_DAC_BUS5: P1.E6(HA05_P)
CH3_DAC_BUS6: P1.F7(HA04_P)
CH3_DAC_BUS7: P1.F8(HA04_N)
CH3_DAC_BUS8: P1.K8(HA02_N)
CH3_DAC_BUS9: P1.K7(HA02_P)
CH3_DAC_BUS10: P1.J7(HA03_N)
CH3_DAC_BUS11: P1.J6(HA03_P)
CH3_DAC_BUS12: P1.F5(HA00_N_CC)
CH3_DAC_BUS13: P1.F4(HA00_P_CC)
CH3_DAC_BUS14: P1.E3(HA01_N_CC)
CH3_DAC_BUS15: P1.E2(HA01_P_CC)
CH3_DAC_BUS_DUP0: P1.K29(HB06_N_CC)
CH3_DAC_BUS_DUP1: P1.K28(HB06_P_CC)
CH3_DAC_BUS_DUP2: P1.J28(HB07_N)
CH3_DAC_BUS_DUP3: P1.J27(HB07_P)
CH3_DAC_BUS_DUP4: P1.E24(HB05_P)
CH3_DAC_BUS_DUP5: P1.E25(HB05_N)
CH3_DAC_BUS_DUP6: P1.F26(HB04_N)
CH3_DAC_BUS_DUP7: P1.F25(HB04_P)
CH3_DAC_BUS_DUP8: P1.K26(HB00_N_CC)
CH3_DAC_BUS_DUP9: P1.K25(HB00_P_CC)
CH3_DAC_BUS_DUP10: P1.J25(HB01_N)
CH3_DAC_BUS_DUP11: P1.J24(HB01_P)
CH3_DAC_BUS_DUP12: P1.F23(HB02_N)
CH3_DAC_BUS_DUP13: P1.F22(HB02_P)
CH3_DAC_BUS_DUP14: P1.E22(HB03_N)
CH3_DAC_BUS_DUP15: P1.E21(HB03_P)
CH4_DAC_BUS0: P1.K23(HA23_N)
CH4_DAC_BUS1: P1.K22(HA23_P)
CH4_DAC_BUS2: P1.J22(HA22_N)
CH4_DAC_BUS3: P1.J21(HA22_P)
CH4_DAC_BUS4: P1.K20(HA21_N)
CH4_DAC_BUS5: P1.K19(HA21_P)
CH4_DAC_BUS6: P1.E18(HA20_P)
CH4_DAC_BUS7: P1.E19(HA20_N)
CH4_DAC_BUS8: P1.J19(HA18_N)
CH4_DAC_BUS9: P1.J18(HA18_P)
CH4_DAC_BUS10: P1.K17(HA17_N_CC)
CH4_DAC_BUS11: P1.K16(HA17_P_CC)
CH4_DAC_BUS12: P1.F20(HA19_N)
CH4_DAC_BUS13: P1.F19(HA19_P)
CH4_DAC_BUS14: P1.E15(HA16_P)
CH4_DAC_BUS15: P1.E16(HA16_N)
CH4_DAC_BUS_DUP0: P1.K35(HB14_N)
CH4_DAC_BUS_DUP1: P1.K34(HB14_P)
CH4_DAC_BUS_DUP2: P1.J34(HB15_N)
CH4_DAC_BUS_DUP3: P1.J33(HB15_P)
CH4_DAC_BUS_DUP4: P1.F32(HB12_N)
CH4_DAC_BUS_DUP5: P1.F31(HB12_P)
CH4_DAC_BUS_DUP6: P1.E31(HB13_N)
CH4_DAC_BUS_DUP7: P1.E30(HB13_P)
CH4_DAC_BUS_DUP8: P1.J30(HB11_P)
CH4_DAC_BUS_DUP9: P1.J31(HB11_N)
CH4_DAC_BUS_DUP10: P1.E27(HB09_P)
CH4_DAC_BUS_DUP11: P1.E28(HB09_N)
CH4_DAC_BUS_DUP12: P1.F28(HB08_P)
CH4_DAC_BUS_DUP13: P1.F29(HB08_N)
CH4_DAC_BUS_DUP14: P1.K31(HB10_P)
CH4_DAC_BUS_DUP15: P1.K32(HB10_N)
DAC3_Car_Clk_N: P1.F14(HA12_N) ; port CH3_DACclocks.CarDACClk_n  [project net CH3_DAC_CLK.CarDACClk_n]
DAC3_Car_Clk_P: P1.F13(HA12_P) ; port CH3_DACclocks.CarDACClk_p  [project net CH3_DAC_CLK.CarDACClk_p]
DAC3_Nul_Clk_N: P1.E13(HA13_N) ; port CH3_DACclocks.NulDACClk_n  [project net CH3_DAC_CLK.NulDACClk_n]
DAC3_Nul_Clk_P: P1.E12(HA13_P) ; port CH3_DACclocks.NulDACClk_p  [project net CH3_DAC_CLK.NulDACClk_p]
DAC4_Car_Clk_N: P1.J16(HA14_N) ; port CH4_DACclocks.CarDACClk_n  [project net CH4_DAC_CLK.CarDACClk_n]
DAC4_Car_Clk_P: P1.J15(HA14_P) ; port CH4_DACclocks.CarDACClk_p  [project net CH4_DAC_CLK.CarDACClk_p]
DAC4_Nul_Clk_N: P1.F17(HA15_N) ; port CH4_DACclocks.NulDACClk_n  [project net CH4_DAC_CLK.NulDACClk_n]
DAC4_Nul_Clk_P: P1.F16(HA15_P) ; port CH4_DACclocks.NulDACClk_p  [project net CH4_DAC_CLK.NulDACClk_p]

Not connected (* = marked no-connect by the designer): P1 E33(HB19_P)* E34(HB19_N)* E36(HB21_P)* E37(HB21_N)* F34(HB16_P)* F37(HB20_P)* F38(HB20_N)* J2(CLK3_BIDIR_P)* J3(CLK3_BIDIR_N)* J36(HB18_P)* J37(HB18_N)* K37(HB17_P_CC)* K38(HB17_N_CC)*

### Buses and harness runs
bus CH3_DAC_BUS[0..15] = sheet Dup1/BusOutA[0..15]
bus CH3_DAC_BUS_DUP[0..15] = sheet Dup1/BusOutB[0..15]
bus CH4_DAC_BUS[0..15] = sheet Dup2/BusOutA[0..15]
bus CH4_DAC_BUS_DUP[0..15] = sheet Dup2/BusOutB[0..15]
bus port CH3_DAC_BUSOUT[0..15] = sheet Dup1/BusIn[0..15]
bus port CH4_DAC_BUSOUT[0..15] = sheet Dup2/BusIn[0..15]
harness CH34_ADC_DAT = port CH34_ADC_DAT

### Layout directives
differential pair: CH3_DAC_CLK.CarDACClk_n, CH3_DAC_CLK.CarDACClk_p, CH3_DAC_CLK.NulDACClk_n, CH3_DAC_CLK.NulDACClk_p, CH4_DAC_CLK.CarDACClk_n, CH4_DAC_CLK.CarDACClk_p, CH4_DAC_CLK.NulDACClk_n, CH4_DAC_CLK.NulDACClk_p, CH34_ADC_DAT.FrameStart_N, CH34_ADC_DAT.FrameStart_P, CH34_ADC_DAT.Out1A_N, CH34_ADC_DAT.Out1A_P, CH34_ADC_DAT.Out1B_N, CH34_ADC_DAT.Out1B_P, CH34_ADC_DAT.Out2A_N, CH34_ADC_DAT.Out2A_P, CH34_ADC_DAT.Out2B_N, CH34_ADC_DAT.Out2B_P

### Notes on the sheet
- Warning: CH3_DAC_BUS pins re-ordered
  K11- 0
  K10- 1
  J10 - 2
  J9- 3
  E7 - 4
  E6 - 5
  F7- 6
  F8 - 7
  K8 - 8
  K7 - 9
  J7 -10
  J6 - 11
  F5 - 12
  F4 - 13
  E3 - 14
  E2 - 15
- Warning: CH3_DAC_BUS_DUB pins re-ordered
  K29 - 0
  K28 - 1
  J28 - 2
  J27 - 3
  E24 - 4
  E25 - 5
  F26 - 6
  F25 - 7
  K26 - 8
  K25 - 9
  J25 -10
  J24 - 11
  F23 - 12
  F22 - 13
  E22 - 14
  E21 - 15
- Warning:
  ADC34 ordering changed
  Out1A_P - E9
  Out1A_N - E10
  Out1B_P - K13
  Out1B_N - K14
  Out2A_P - F10
  Out2A_N -F11 Out2B_P -K4
  Out2B_N - K5
  DR_P - C22
  DR_N - C23
  FR_P - J12
  FR_N - J13
  Enc_P - D20
  Enc_N - D21
- (near R60) Buck sync can be provided from 3 different locations - see power page, this page and rowsCDGH
- FMC HPC connector
- (near R60) Warning: CH4_DAC_BUS pins re-ordered
  K23- 0
  K22- 1
  J22- 2
  J21 - 3
  K20  - 4
  K19 - 5
  E18- 6
  E19 - 7
  J19- 8
  J18- 9
  K17-10
  K16- 11
  F20 - 12
  F19- 13
  E15- 14
  E16- 15
- Warning: CH4_DAC_BUS_DUP pins re-ordered
  K35- 0
  K34- 1
  J34- 2
  J33 - 3
  F32 - 4
  F31 - 5
  E31 - 6
  E30- 7
  J30- 8
  J31- 9
  E27-10
  E28- 11
  F28- 12
  F29- 13
  K31- 14
  K32- 15
- File:
- Size:
- Date:
- Letter
- Revision:
- Sheet
- of
- Cosmology
- Drawn by:

### Library data of the parts
P1 = Samtec - ASP-134602-01: as P1 on sheet FMCio_rowsAB; Manufacturer: Samtec; Part constraints: Samtec ASP-134602-01; Manufacturer Part Number 1: Samtec ASP-134602-01
R60 = Res1812: RES 0.0 OHM 1/8W 0805 SMD; Manufacturer: e.g Vishay/Dale; Part constraints: 0Ohm jumper, >=4A, 0805, <=5mOhms; Manufacturer Part Number 1: e.g CRCW08050000Z0EAHP; Value: 0; Assembly Comments: none; Supplier 1: Newark; Supplier Part Number 1: 68R2993

## Sheet BusDup.SchDoc
size Letter; Author: Adam Gilbert; CompanyName: McGill University; DrawnBy: Adam Gilbert; Organization: Altium Limited; Address1: McGill Cosmology; Address2: 3600 University Street; Address3: Montreal, Quebec; Address4: Canada; DocumentNumber: 14; Revision: Rev2; SheetNumber: 14; SheetTotal: 16; ProjectTitle: DfMux FMC Mezz; ModelNumber: MGMEZZ04; ProjectName: DfMux FMC Mezz
Used 2 times, as channels U_FMCio_rowsEFJK/Dup2, U_FMCio_rowsEFJK/Dup1. Parts and nets are listed once, with the designators drawn on the sheet.
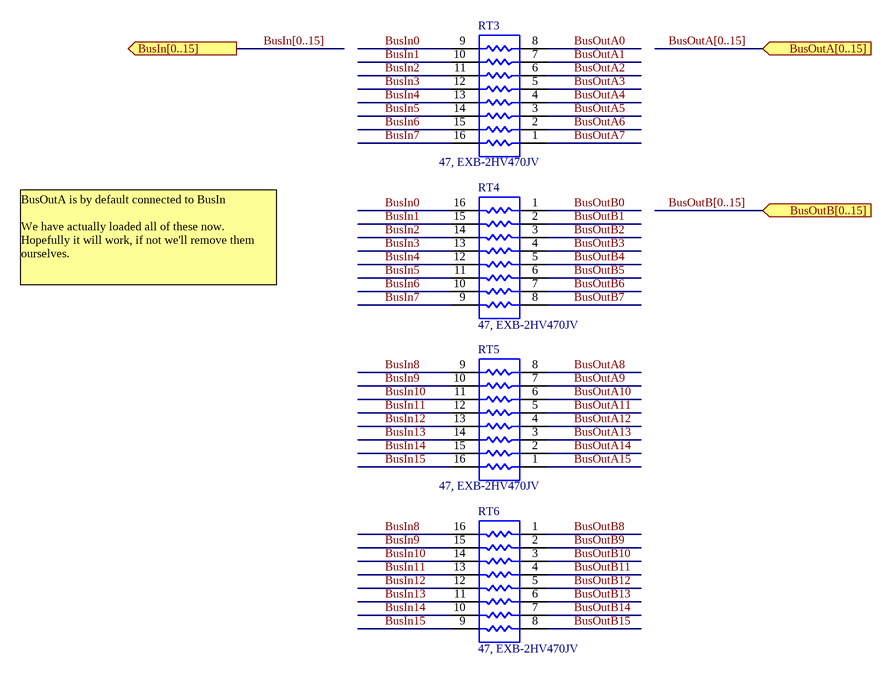
[diagram p4: BusDup.SchDoc]

### Parts
RT3  47, EXB-2HV470JV  [0402_Array_2HV]
RT4  47, EXB-2HV470JV  [0402_Array_2HV]
RT5  47, EXB-2HV470JV  [0402_Array_2HV]
RT6  47, EXB-2HV470JV  [0402_Array_2HV]

### Ports
BusIn[0..15] (out), BusOutA[0..15] (in), BusOutB[0..15] (in)

### Nets
BusIn0: RT3.9 RT4.16
BusIn1: RT3.10 RT4.15
BusIn2: RT3.11 RT4.14
BusIn3: RT3.12 RT4.13
BusIn4: RT3.13 RT4.12
BusIn5: RT3.14 RT4.11
BusIn6: RT3.15 RT4.10
BusIn7: RT3.16 RT4.9
BusIn8: RT5.9 RT6.16
BusIn9: RT5.10 RT6.15
BusIn10: RT5.11 RT6.14
BusIn11: RT5.12 RT6.13
BusIn12: RT5.13 RT6.12
BusIn13: RT5.14 RT6.11
BusIn14: RT5.15 RT6.10
BusIn15: RT5.16 RT6.9
BusOutA0: RT3.8
BusOutA1: RT3.7
BusOutA2: RT3.6
BusOutA3: RT3.5
BusOutA4: RT3.4
BusOutA5: RT3.3
BusOutA6: RT3.2
BusOutA7: RT3.1
BusOutA8: RT5.8
BusOutA9: RT5.7
BusOutA10: RT5.6
BusOutA11: RT5.5
BusOutA12: RT5.4
BusOutA13: RT5.3
BusOutA14: RT5.2
BusOutA15: RT5.1
BusOutB0: RT4.1
BusOutB1: RT4.2
BusOutB2: RT4.3
BusOutB3: RT4.4
BusOutB4: RT4.5
BusOutB5: RT4.6
BusOutB6: RT4.7
BusOutB7: RT4.8
BusOutB8: RT6.1
BusOutB9: RT6.2
BusOutB10: RT6.3
BusOutB11: RT6.4
BusOutB12: RT6.5
BusOutB13: RT6.6
BusOutB14: RT6.7
BusOutB15: RT6.8

### Channels
U_FMCio_rowsEFJK/Dup2: designators end in A
U_FMCio_rowsEFJK/Dup1: designators end in B

### Buses and harness runs
bus BusIn[0..15] = port BusIn[0..15]
bus BusOutA[0..15] = port BusOutA[0..15]
bus BusOutB[0..15] = port BusOutB[0..15]

### Notes on the sheet
- BusOutA is by default connected to BusIn
  We have actually loaded all of these now. Hopefully it will work, if not we'll remove them ourselves.
- File:
- Size:
- Date:
- Letter
- Revision:
- Sheet
- of
- Cosmology
- Drawn by:

### Library data of the parts
RT3-RT6 = Res_Pack: RES ARRAY 47 OHM SMD; Manufacturer: Panasonic - ECG; Assembly Comments: none; Part constraints: EXB-2HV470JV; Manufacturer Part Number 1: EXB-2HV470JV; Supplier 1: Digikey; Supplier Part Number 1: Y1470CT-ND

## Sheet FMCPower.SchDoc
size Letter; PageSetup: Record=PageOptions|CenterHorizontal=True|CenterVertical=True|PrintScale=1.00|XCorrection=1.00|YCorrection=1.00|PrintKind=0|BorderSize=5000000|LeftOffset=0|BottomOffset=0|Orientation=2|PaperLength=1000|PaperWidth=1000|Scale=100|PaperSource=7|PrintQuality=-4|MediaType=1|DitherType=10|PaperKind=Letter|PrintScaleMode=1; Author: Adam Gilbert; CompanyName: McGill University; DrawnBy: Adam Gilbert; Organization: Altium Limited; Address1: McGill Cosmology; Address2: 3600 University Street; Address3: Montreal, Quebec; Address4: Canada; DocumentNumber: 2; Revision: Rev2; SheetNumber: 2; SheetTotal: 16; ProjectTitle: DfMux FMC Mezz; ModelNumber: MGMEZZ04; ProjectName: DfMux FMC Mezz
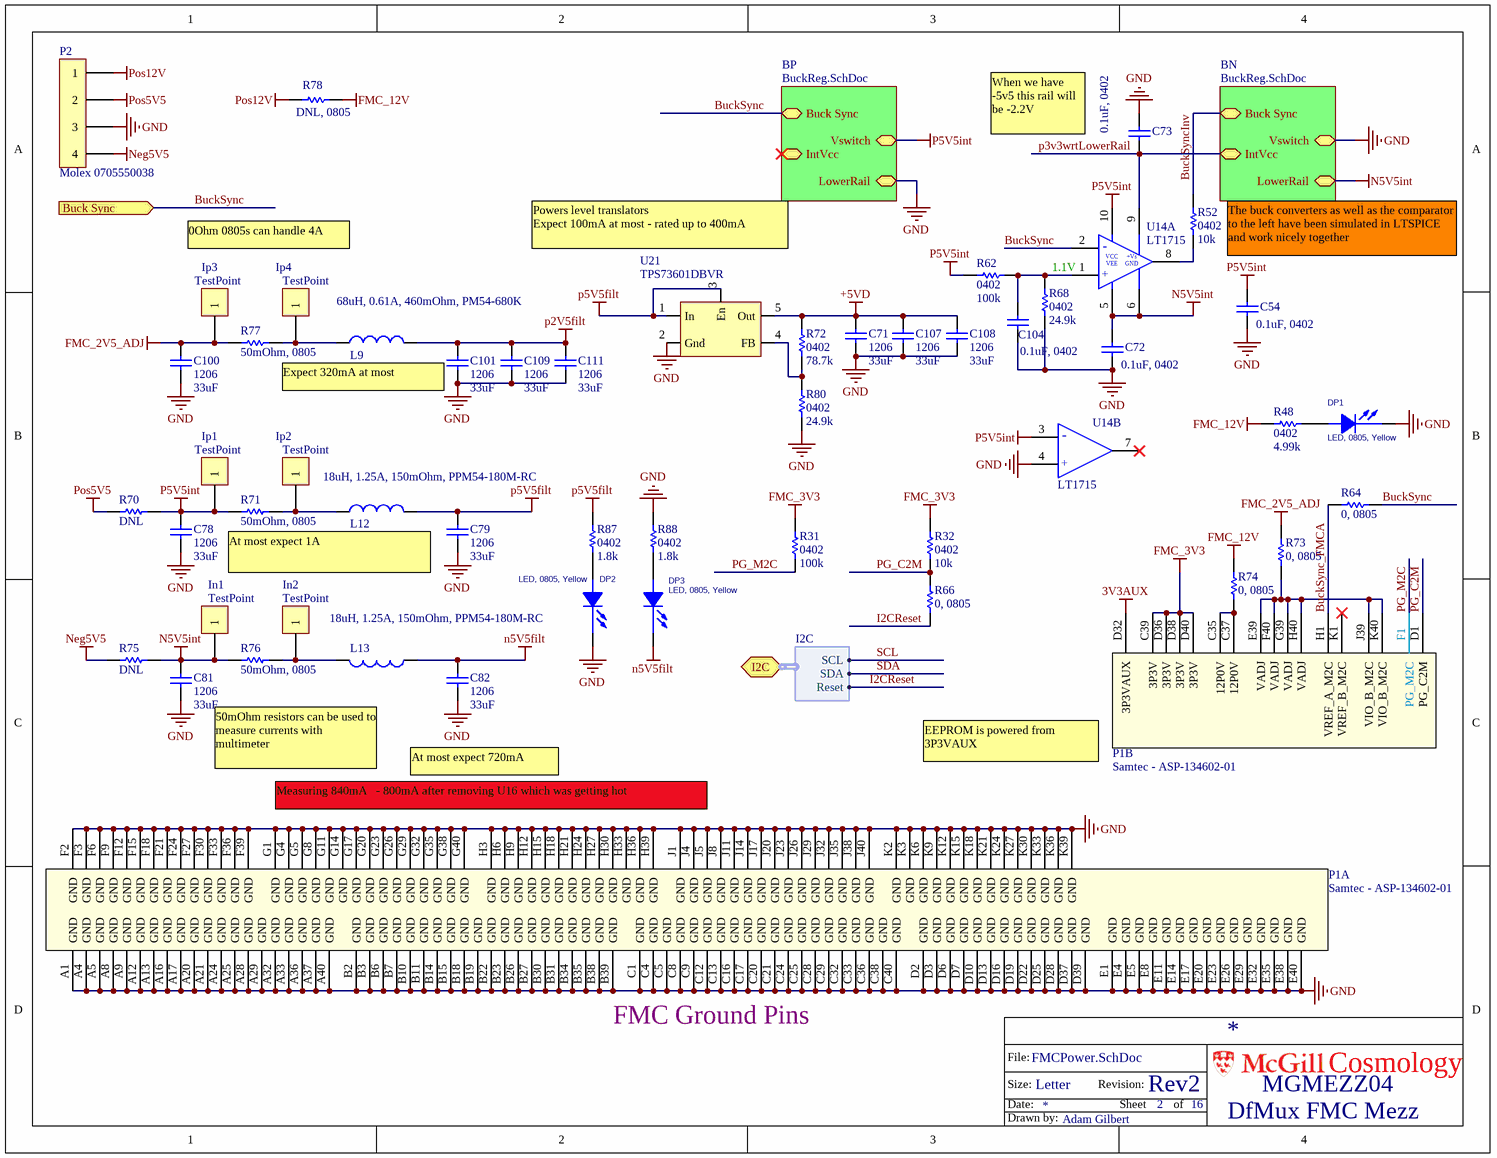
[diagram p5: FMCPower.SchDoc]

### Parts
C54  0.1uF, 0402  [0402]
C71  Footprint: 1206  [CC3225-1210]  (hidden comment: 33uF)
C72  0.1uF, 0402  [0402]
C73  0.1uF, 0402  [0402]
C78  Footprint: 1206  [CC3225-1210]  (hidden comment: 33uF)
C79  Footprint: 1206  [CC3225-1210]  (hidden comment: 33uF)
C81  Footprint: 1206  [CC3225-1210]  (hidden comment: 33uF)
C82  Footprint: 1206  [CC3225-1210]  (hidden comment: 33uF)
C100  Footprint: 1206  [CC3225-1210]  (hidden comment: 33uF)
C101  Footprint: 1206  [CC3225-1210]  (hidden comment: 33uF)
C104  0.1uF, 0402  [0402]
C107  Footprint: 1206  [CC3225-1210]  (hidden comment: 33uF)
C108  Footprint: 1206  [CC3225-1210]  (hidden comment: 33uF)
C109  Footprint: 1206  [CC3225-1210]  (hidden comment: 33uF)
C111  Footprint: 1206  [CC3225-1210]  (hidden comment: 33uF)
DP1  LED, 0805, Yellow  [0805L]
DP2  LED, 0805, Yellow  [0805L]
DP3  LED, 0805, Yellow  [0805L]
In1  TestPoint  [TP-3520-SK]  (no BOM)
In2  TestPoint  [TP-3520-SK]  (no BOM)
Ip1  TestPoint  [TP-3520-SK]  (no BOM)
Ip2  TestPoint  [TP-3520-SK]  (no BOM)
Ip3  TestPoint  [TP-3520-SK]  (no BOM)
Ip4  TestPoint  [TP-3520-SK]  (no BOM)
L9  Part Constraints: 68uH, 0.61A, 460mOhm, PM54-680K  [CHOKEPM54]  (hidden comment: 68uH)
L12  Part Constraints: 18uH, 1.25A, 150mOhm, PPM54-180M-RC  [CHOKEPM54]  (hidden comment: 18uH)
L13  Part Constraints: 18uH, 1.25A, 150mOhm, PPM54-180M-RC  [CHOKEPM54]  (hidden comment: 18uH)
P1  Samtec - ASP-134602-01  [BTB-SM1-27-2V400M]  (parts A,B of 14)
P2  Molex 0705550038  [Molex0705550038]
R31  100k  [0402]
R32  10k  [0402]
R48  4.99k  [0402]
R52  10k  [0402]
R62  100k  [0402]
R64  0, 0805  [0805]
R66  0, 0805  [0805]
R68  24.9k  [0402]
R70  DNL  [0805]
R71  50mOhm, 0805  [0805]
R72  78.7k  [0402]
R73  0, 0805  [0805]
R74  0, 0805  [0805]
R75  DNL  [0805]
R76  50mOhm, 0805  [0805]
R77  50mOhm, 0805  [0805]
R78  DNL, 0805  [0805]
R80  24.9k  [0402]
R87  1.8k  [0402]
R88  1.8k  [0402]
U14  LT1715  [TSSOP50P490X110-10N]  (parts A,B of 2)
U21  TPS73601DBVR  [SOT23-5]

### Sub-sheets
BN = BuckReg.SchDoc: Buck Sync, LowerRail, Vswitch, IntVcc
BP = BuckReg.SchDoc: Buck Sync, LowerRail, Vswitch, IntVcc

### Ports
Buck Sync (in), I2C (harness I2C)

### Harnesses
I2C: SCL, SDA, Reset

### Nets
3V3AUX: P1.D32(3P3VAUX)
+5VD: C71.1 C107.1 C108.1 R72.2 U21.5(Out)
FMC_2V5_ADJ: C100.1 Ip3.1 R73.2 R77.1
FMC_3V3: P1.C39(3P3V) P1.D36(3P3V) P1.D38(3P3V) P1.D40(3P3V) R31.1 R32.1
FMC_12V: R48.1 R74.2 R78.2
GND: C54.1 C71.2 C72.1 C73.2 C78.2 C79.2 C81.2 C82.2 C100.2 C101.2 C104.1 C107.2 C108.2 C109.2 C111.2 DP1.2(CATHODE) DP2.2(CATHODE) P1.A1(GND) P1.A4(GND) P1.A5(GND) P1.A8(GND) P1.A9(GND) P1.A12(GND) P1.A13(GND) P1.A16(GND) P1.A17(GND) P1.A20(GND) P1.A21(GND) P1.A24(GND) P1.A25(GND) P1.A28(GND) P1.A29(GND) P1.A32(GND) P1.A33(GND) P1.A36(GND) P1.A37(GND) P1.A40(GND) P1.B2(GND) P1.B3(GND) P1.B6(GND) P1.B7(GND) P1.B10(GND) P1.B11(GND) P1.B14(GND) P1.B15(GND) P1.B18(GND) P1.B19(GND) P1.B22(GND) P1.B23(GND) P1.B26(GND) P1.B27(GND) P1.B30(GND) P1.B31(GND) P1.B34(GND) P1.B35(GND) P1.B38(GND) P1.B39(GND) P1.C1(GND) P1.C4(GND) P1.C5(GND) P1.C8(GND) P1.C9(GND) P1.C12(GND) P1.C13(GND) P1.C16(GND) P1.C17(GND) P1.C20(GND) P1.C21(GND) P1.C24(GND) P1.C25(GND) P1.C28(GND) P1.C29(GND) P1.C32(GND) P1.C33(GND) P1.C36(GND) P1.C38(GND) P1.C40(GND) P1.D2(GND) P1.D3(GND) P1.D6(GND) P1.D7(GND) P1.D10(GND) P1.D13(GND) P1.D16(GND) P1.D19(GND) P1.D22(GND) P1.D25(GND) P1.D28(GND) P1.D37(GND) P1.D39(GND) P1.E1(GND) P1.E4(GND) P1.E5(GND) P1.E8(GND) P1.E11(GND) P1.E14(GND) P1.E17(GND) P1.E20(GND) P1.E23(GND) P1.E26(GND) P1.E29(GND) P1.E32(GND) P1.E35(GND) P1.E38(GND) P1.E40(GND) P1.F2(GND) P1.F3(GND) P1.F6(GND) P1.F9(GND) P1.F12(GND) P1.F15(GND) P1.F18(GND) P1.F21(GND) P1.F24(GND) P1.F27(GND) P1.F30(GND) P1.F33(GND) P1.F36(GND) P1.F39(GND) P1.G1(GND) P1.G4(GND) P1.G5(GND) P1.G8(GND) P1.G11(GND) P1.G14(GND) P1.G17(GND) P1.G20(GND) P1.G23(GND) P1.G26(GND) P1.G29(GND) P1.G32(GND) P1.G35(GND) P1.G38(GND) P1.G40(GND) P1.H3(GND) P1.H6(GND) P1.H9(GND) P1.H12(GND) P1.H15(GND) P1.H18(GND) P1.H21(GND) P1.H24(GND) P1.H27(GND) P1.H30(GND) P1.H33(GND) P1.H36(GND) P1.H39(GND) P1.J1(GND) P1.J4(GND) P1.J5(GND) P1.J8(GND) P1.J11(GND) P1.J14(GND) P1.J17(GND) P1.J20(GND) P1.J23(GND) P1.J26(GND) P1.J29(GND) P1.J32(GND) P1.J35(GND) P1.J38(GND) P1.J40(GND) P1.K2(GND) P1.K3(GND) P1.K6(GND) P1.K9(GND) P1.K12(GND) P1.K15(GND) P1.K18(GND) P1.K21(GND) P1.K24(GND) P1.K27(GND) P1.K30(GND) P1.K33(GND) P1.K36(GND) P1.K39(GND) P2.3 R68.2 R80.1 R88.1 U14.4(+) U21.2(Gnd) ; sheet BP/LowerRail, sheet BN/Vswitch
n5V5filt: C82.1 DP3.2(CATHODE) L13.1
N5V5int: C72.2 C81.1 In1.1 R75.1 R76.1 U14.5(Vee) U14.6(Gnd) ; sheet BN/LowerRail
Neg5V5: P2.4 R75.2
p2V5filt: C101.1 C109.1 C111.1 L9.2
p5V5filt: C79.1 L12.2 R87.1 U21.1(In) U21.3(En)
P5V5int: C54.2 C78.1 Ip1.1 R62.1 R70.1 R71.1 U14.3(-) U14.10(Vcc) ; sheet BP/Vswitch
Pos5V5: P2.2 R70.2
Pos12V: P2.1 R78.1
BuckSync: R64.1 U14.2(-) ; port Buck Sync, sheet BP/Buck Sync
BuckSync_FMCA: P1.H1(VREF_A_M2C) R64.2
BuckSyncInv: R52.1 ; sheet BN/Buck Sync
I2CReset: R66.2 ; port I2C.Reset  [project net I2C.Reset]
p3v3wrtLowerRail: C73.1 U14.9(Vs) ; sheet BN/IntVcc
PG_C2M: P1.D1(PG_C2M) R32.2 R66.1
PG_M2C: P1.F1(PG_M2C) R31.2
NetC104_2: C104.2 R62.2 R68.1 U14.1(+)
NetDP1_1: DP1.1(ANODE) R48.2
NetDP2_1: DP2.1(ANODE) R87.2
NetDP3_1: DP3.1(ANODE) R88.2
NetIn2_1: In2.1 L13.2 R76.2
NetIp2_1: Ip2.1 L12.1 R71.2
NetIp4_1: Ip4.1 L9.1 R77.2
NetP1_C35: P1.C35(12P0V) P1.C37(12P0V) R74.1
NetP1_E39: P1.E39(VADJ) P1.F40(VADJ) P1.G39(VADJ) P1.H40(VADJ) P1.J39(VIO_B_M2C) P1.K40(VIO_B_M2C) R73.1
NetR52_2: R52.2 U14.8(Out)
NetR72_1: R72.1 R80.2 U21.4(FB)

Not connected (* = marked no-connect by the designer): P1 K1(VREF_B_M2C)*; U14 7(Out)*

### Notes on the sheet
- When we have -5v5 this rail will be -2.2V
- 0Ohm 0805s can handle 4A
- Powers level translators
  Expect 100mA at most - rated up to 400mA
- 1.1V
- The buck converters as well as the comparator to the left have been simulated in LTSPICE and work nicely together
- Expect 320mA at most
- At most expect 1A
- 50mOhm resistors can be used to measure currents with multimeter
- At most expect 720mA
- EEPROM is powered from 3P3VAUX
- Measuring 840mA   - 800mA after removing U16 which was getting hot
- (near P1) FMC Ground Pins
- File:
- Size:
- Date:
- Letter
- Revision:
- Sheet
- of
- Cosmology
- Drawn by:
- (in symbol LT1715, part A) VCC; +Vs; VEE; GND

### Library data of the parts
C54 C72 C73 C104 = CAP 0603: as C58 on sheet MGMEZZ04; Value: 0.1uF, 0402; Supplier 1: Digi-Key; Supplier Part Number 1: 445-1265-1-ND; Operating Temperature: -55°C ~ 85°C; Thickness (Max): 0.022" (0.55mm); Packaging: Cut Tape (CT)
C71 C78 C79 C81 C82 C100 C101 C107-C109 C111 = CAP 1210: Capacitor, Ceramic, 1210; Manufacturer: TDK Corporation; Part Constraints: 33uF or 47uF  (1206 or 1210) 25V X5R; Manufacturer Part Number 1: C3216X5R1E336M; Assembly Comments: none; Temperature Coefficient: X5R; Value: 33uF; Supplier 1: Digi-Key; Supplier Part Number 1: 445-8046-1-ND; Operating Temperature: -55°C ~ 85°C; Packaging: Cut Tape (CT)
DP1-DP3 = LED, yellow, 0805, 2mA: LED; Part Constraints: SML-211YTT86; Manufacturer: Rohm Semiconductor; Assembly Comments: none; Supplier 1: Digi-Key; Supplier Part Number 1: 511-1293-1-ND; Manufacturer Part Number 1: SML-211YTT86
In1 In2 Ip1-Ip4 = TestPoint: TestPoint1; Assembly Comments: none; Footprint: *
L9 = INDPM54: Inductor PM54; Manufacturer: Bourns Inc.; Manufacturer Part Number 1: PM54-680K; Assembly Comments: none; Footprint: PM54; Supplier 1: Digi-Key; Supplier Part Number 1: M8524CT-ND; Value: 68uH
L12 L13 = INDPM54: INDUCTOR UNSHIELD 18UH 1.25A SMD; Manufacturer Part Number 1: PM54-180M-RC; Manufacturer: Bourns Inc.; Assembly Comments: none; Value: 18uH; Supplier 1: Digi-Key; Supplier Part Number 1: M8516CT-ND; Packaging: Cut Tape (CT); Operating Temperature: -40°C ~ 125°C
P1 = Samtec - ASP-134602-01: as P1 on sheet FMCio_rowsAB; Manufacturer: Samtec; Part constraints: Samtec ASP-134602-01; Manufacturer Part Number 1: Samtec ASP-134602-01
P2 = Molex 4pin header - 0705550038: Assembly comments: none; Manufacturer: Molex; Manufacturer Part Number 1: 0705550038; Part Constraints: 0705550038; Supplier 1: Digikey; Supplier Part Number 1: WM4177-ND
R31 R32 R48 R52 R62 R68 R72 R80 R87 R88 = RES 0402: as R56 on sheet MGMEZZ04; Manufacturer Part Number 1: Generic
  R31 R62: Value: 100k
  R32 R52: Value: 10k
  R48: Value: 4.99k
  R68 R80: Value: 24.9k
  R72: Value: 78.7k
  R87 R88: Value: 1.8k
R64 R66 R70 R73-R75 = Res1812: as R60 on sheet FMCio_rowsEFJK; Supplier 1: Newark; Supplier Part Number 1: 68R2993
R71 R76 R77 = RES 0805: RES 50mOHM 1/4W 0805 SMD; Part constraints: ERJ-L06KF50MV; Manufacturer: Panasonic Electronic Components; Temperature Coefficient: ±100ppm/°C; Assembly Comments: none; Value: 50mOhm, 0805; Supplier 1: Digi-Key; Supplier Part Number 1: P50LLCT-ND; Manufacturer Part Number 1: ERJ-L06KF50MV; Packaging: Cut Tape (CT)
R78 = RES 0805: RES 0.0 OHM 1/8W 0805 SMD; Manufacturer: Generic; Part constraints: 1% 100ppm 1/8W 0805; Assembly Comments: none; Value: DNL, 0805; Manufacturer Part Number 1: Generic
U14 = LT1715: IC COMPARATOR 150MHZ DUAL 10MSOP; Manufacturer Part Number 1: LT1715IMS#PBF; Manufacturer: Linear Technology; Assembly Comments: none; Supplier 1: Digi-Key; Operating Temperature: -40°C ~ 85°C; Packaging: Tube; Supplier Part Number 1: LT1715IMS#PBF-ND; Part Constraints: LT1715IMS#PBF
U21 = TPS73601DBVR: Adjustable 30uVrms noise 400mA regulator; Manufacturer Part Number 1: TPS73601DBVT; Manufacturer: Texas Instruments; Assembly Comments: none; Supplier 1: Digi-Key; Operating Temperature: -40°C ~ 125°C; Packaging: Cut Tape (CT); Supplier Part Number 1: 296-15814-1-ND; Part Constraints: TPS73601DBVT